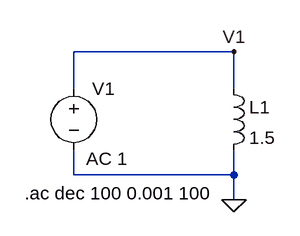
[diagram p0: schematic inductor.asc]
inductor.asc, the LTspice schematic file:
Version 4
SHEET 1 880 680
WIRE 256 64 48 64
WIRE 48 112 48 64
WIRE 256 112 256 64
WIRE 48 224 48 192
WIRE 256 224 256 192
WIRE 256 224 48 224
WIRE 256 256 256 224
FLAG 256 256 0
FLAG 256 64 V1
SYMBOL voltage 48 96 R0
WINDOW 123 16 107 Left 2
WINDOW 39 0 0 Left 0
SYMATTR InstName V1
SYMATTR Value ""
SYMATTR Value2 AC 1
SYMBOL ind 240 96 R0
SYMATTR InstName L1
SYMATTR Value 1.5
TEXT -16 248 Left 2 !.ac dec 100 0.001 100

The netlist it stands for:
* inductor.asc
V1 V1 0 AC 1
L1 V1 0 1.5
.ac dec 100 0.001 100
.backanno
.end